# Altium schematic sheet SWAP_21DD_ LV_DR_Brush_Rev1.1.SchDoc
size Letter; SheetNumber: 1; SheetTotal: 1
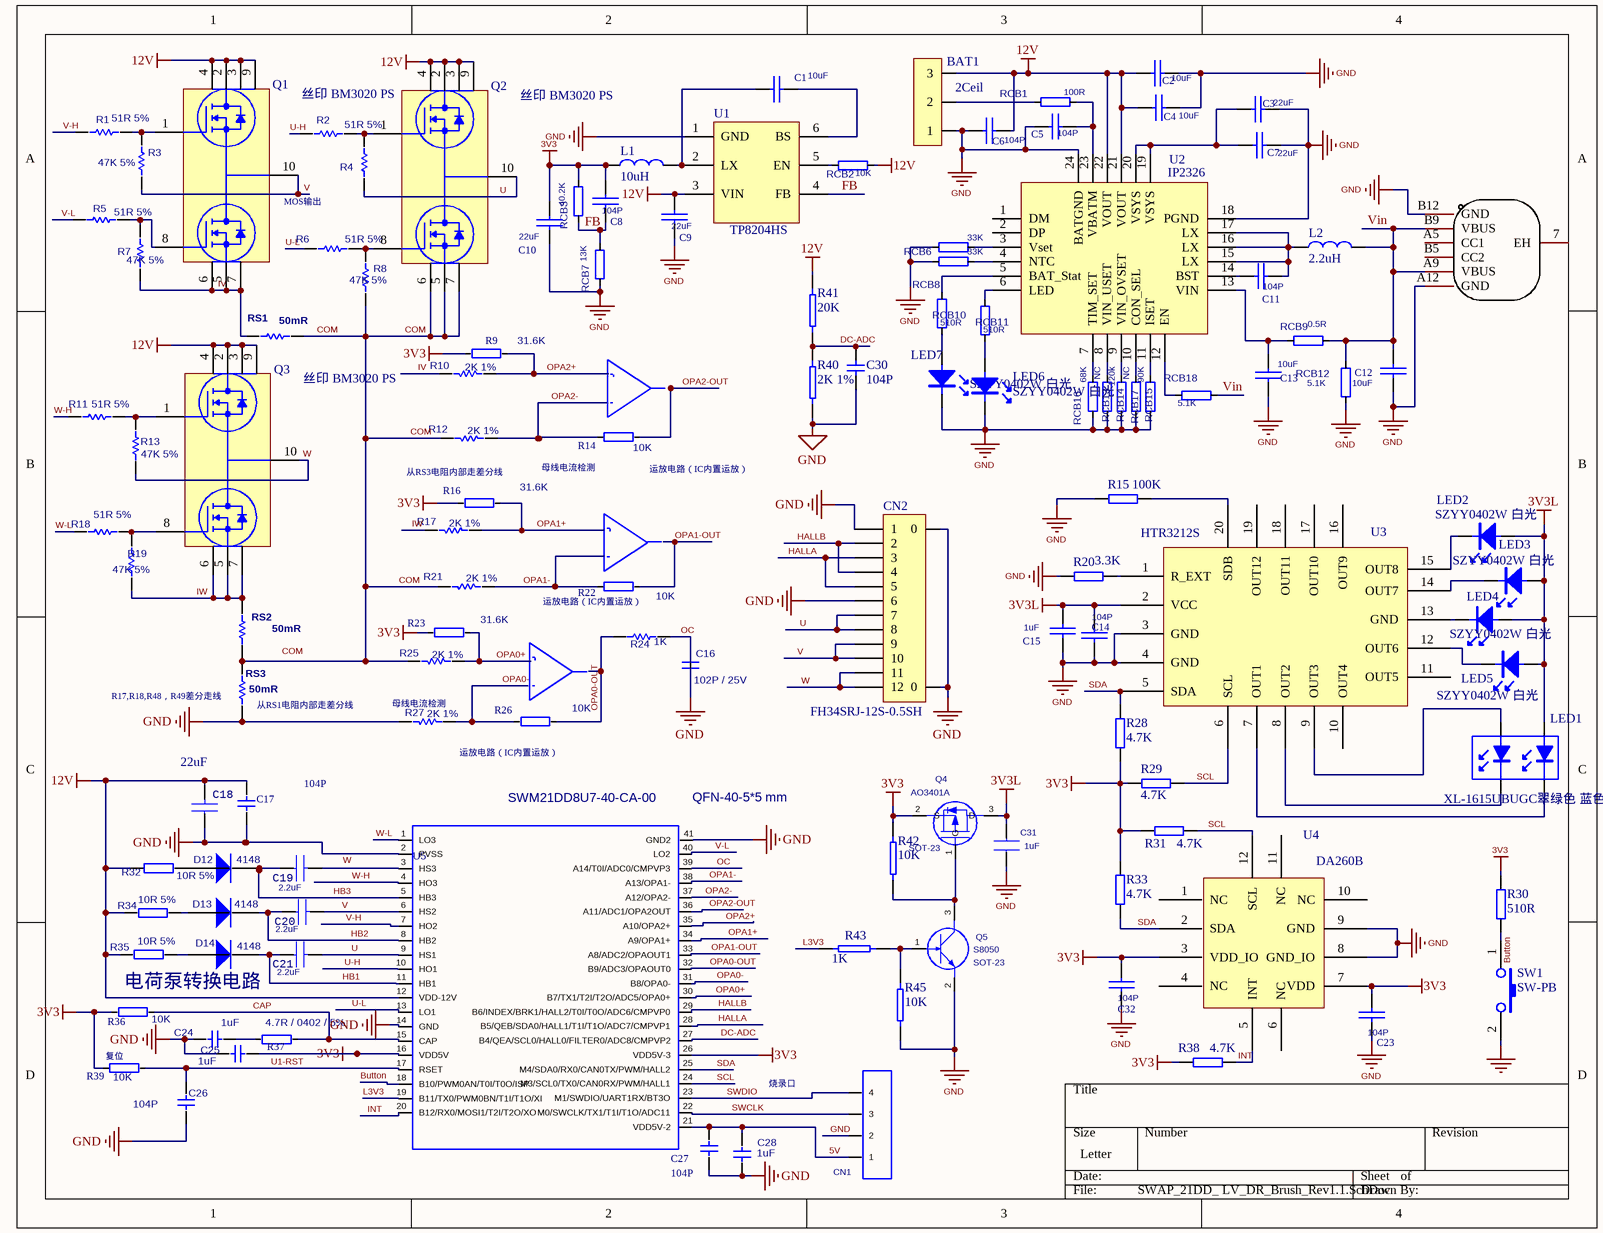
[diagram p0: SWAP_21DD_ LV_DR_Brush_Rev1.1.SchDoc]

## Parts
BAT1  2Ceil  [HDR1X3]
C1  10uF  [LC-0603_C]
C2  10uF  [LC-0603_C]
C3  22uF  [LC-0603_C]
C4  10uF  [LC-0603_C]
C5  104P  [LC-0402_C]
C6  104P  [LC-0402_C]
C7  22uF  [LC-0603_C]
C8  104P  [LC-0402_C]
C9  22uF  [LC-0603_C]
C10  22uF  [LC-0603_C]
C11  104P  [LC-0402_C]
C12  10uF  [LC-0402_C]
C13  10uF  [LC-0402_C]
C14  104P  [LC-0402_C]
C15  1uF  [LC-0402_C]
C16  102P / 25V  [LC-0402_C]
C17  104P  [LC-0402_C]
C18  22uF  [LC-0603_C]
C19  2.2uF  [LC-0603_C]
C20  2.2uF  [LC-0603_C]
C21  2.2uF  [LC-0603_C]
C23  104P  [LC-0402_C]
C24  1uF  [LC-0402_C]
C25  1uF  [LC-0402_C]
C26  104P  [LC-0402_C]
C27  104P  [LC-0402_C]
C28  1uF  [LC-0402_C]
C30  104P  [LC-0402_C]
C31  1uF  [LC-0402_C]
C32  104P  [LC-0402_C]
CN1  SWD1  [XH2.54-SMD4P]  (value not drawn)
CN2  FH34SRJ-12S-0.5SH  [SMD-12]
D12  4148  [LC-SOD-323]
D13  4148  [LC-SOD-323]
D14  4148  [LC-SOD-323]
L1  10uH  [L_0805]
L2  2.2uH  [L1206]
LED1  XL-1615UBUGC翠绿色 蓝色  [LED0402-4]
LED2  SZYY0402W 白光  [LED0402]
LED3  SZYY0402W 白光  [LED0402]
LED4  SZYY0402W 白光  [LED0402]
LED5  SZYY0402W 白光  [LED0402]
LED6  SZYY0402W 白光  [LED0402]
LED7  SZYY0402W 白光  [LED0402]
Q1  丝印 BM3020 PS  [DFN-3x3_8]
Q2  丝印 BM3020 PS  [DFN-3x3_8]
Q3  丝印 BM3020 PS  [DFN-3x3_8]
Q4  PCB DECAL: SOT-23  [LC-SOT-23(SOT-23-3)]  (hidden comment: AO3401A)
Q5  PCB DECAL: SOT-23  [SOT-723]  (hidden comment: S8050)
R1  51R 5%  [LC-0402_R]
R2  51R 5%  [LC-0402_R]
R3  47K 5%  [LC-0402_R]
R4  47K 5%  [LC-0402_R]  (value not drawn)
R5  51R 5%  [LC-0402_R]
R6  51R 5%  [LC-0402_R]
R7  47K 5%  [LC-0402_R]
R8  47K 5%  [LC-0402_R]
R9  31.6K  [LC-0402_R]
R10  2K 1%  [LC-0402_R]
R11  51R 5%  [LC-0402_R]
R12  2K 1%  [LC-0402_R]
R13  47K 5%  [LC-0402_R]
R14  10K  [LC-0402_R]
R15  100K  [LC-0402_R]
R16  31.6K  [LC-0402_R]
R17  2K 1%  [LC-0402_R]
R18  51R 5%  [LC-0402_R]
R19  47K 5%  [LC-0402_R]
R20  3.3K  [LC-0402_R]
R21  2K 1%  [LC-0402_R]
R22  10K  [LC-0402_R]
R23  31.6K  [LC-0402_R]
R24  1K  [LC-0402_R]
R25  2K 1%  [LC-0402_R]
R26  10K  [LC-0402_R]
R27  2K 1%  [LC-0402_R]
R28  4.7K  [LC-0402_R]
R29  4.7K  [LC-0402_R]
R30  510R  [LC-0402_R]
R31  4.7K  [LC-0402_R]
R32  10R 5%  [LC-0402_R]
R33  4.7K  [LC-0402_R]
R34  10R 5%  [LC-0402_R]
R35  10R 5%  [LC-0402_R]
R36  10K  [LC-0402_R]
R37  4.7R / 0402 / 5%  [LC-0402_R]
R38  4.7K  [LC-0402_R]
R39  10K  [LC-0402_R]
R40  2K 1%  [LC-0402_R]
R41  20K  [LC-0402_R]
R42  10K  [LC-0402_R]
R43  1K  [LC-0402_R]
R45  10K  [LC-0402_R]
RCB1  100R  [LC-0402_R]
RCB2  10K  [LC-0402_R]
RCB3  40.2K  [LC-0402_R]
RCB6  33K  [LC-0402_R]
RCB7  13K  [LC-0402_R]
RCB8  33K  [LC-0402_R]
RCB9  0.5R  [LC-0402_R]
RCB10  510R  [LC-0402_R]
RCB11  510R  [LC-0402_R]
RCB12  5.1K  [LC-0402_R]
RCB13  NC  [LC-0402_R]
RCB14  120k  [LC-0402_R]
RCB15  90K  [LC-0402_R]
RCB16  68K  [LC-0402_R]
RCB17  NC  [LC-0402_R]
RCB18  5.1K  [LC-0402_R]
RS1  50mR  [LC-0805_R]
RS2  50mR  [LC-0805_R]
RS3  50mR  [LC-0805_R]
SW1  SW-PB  [SW SMD-3*6*2.5]
U1  TP8204HS  [LC-SOT-23-6]
U2  IP2326  [QFN-24]
U3  HTR3212S  [QFN-20]
U4  DA260B  [LGA12]
U5  QFN32  [QFN40]  (value not drawn)
USB1  TYPE-C 6P(073)  [TYPE-C-SMD_6P]  (value not drawn)

## Nets
3V3: C8.1 C10.1 C23.1 C25.1 C32.1 L1.2 Q4.2(S) R9.2 R16.2 R23.2 R28.2 R29.1 R30.1 R31.1 R33.2 R36.1 R38.2 R39.1 R42.2 RCB3.2 U4.3(VDD_IO) U4.7(VDD) U5.16(VDD5V) U5.26(VDD5V-3)
3V3L: C14.1 C15.1 C31.1 LED1.3 LED2.1 LED3.1 LED4.1 LED5.1 Q4.3(D) U3.2(VCC)
12V: BAT1.3 C2.2 C4.2 C6.1 C9.1 C17.2 C18.2 Q1.2(D1) Q1.3(D1) Q1.4(D1) Q1.9(D1) Q2.2(D1) Q2.3(D1) Q2.4(D1) Q2.9(D1) Q3.2(D1) Q3.3(D1) Q3.4(D1) Q3.9(D1) R32.1 R34.1 R35.1 R41.2 RCB2.1 U1.3(VIN) U2.21(VOUT) U2.22(VOUT) U5.12(VDD-12V)
GND: BAT1.1 C2.1 C3.1 C4.1 C5.2 C6.2 C7.1 C9.2 C10.2 C12.2 C13.2 C14.2 C15.2 C16.1 C17.1 C18.1 C23.2 C24.1 C25.2 C26.2 C27.1 C28.1 C30.1 C31.2 C32.2 CN1.2 CN2.0 CN2.1 CN2.6 LED6.2 LED7.2 Q5.2(E) R15.2 R20.2 R27.1 R40.1 R45.2 RCB6.2 RCB7.1 RCB8.2 RCB12.2 RCB13.2 RCB14.2 RCB15.2 RCB16.2 RCB17.2 RS3.1 SW1.2 U1.1(GND) U2.18(PGND) U2.24(BATGND) U3.3(GND) U3.4(GND) U4.8(GND_IO) U4.9(GND) U5.2(PVSS) U5.14(GND) U5.41(GND2) USB1.A12(GND) USB1.B12(GND)
5V: C27.2 C28.2 CN1.1 U5.21(VDD5V-2)
Button: R30.2 SW1.1 U5.18(B10/PWM0AN/T0I/T0O/ISP)
CAP: R36.2 R37.2 U5.15(CAP)
COM: Q2.5(S2) Q2.6(S2) Q2.7(S2) R8.1 R12.1 R21.1 R25.1 RS1.1 RS2.1 RS3.2
DC-ADC: C30.2 R40.2 R41.1 U5.27(B4/QEA/SCL0/HALL0/FILTER0/ADC8/CMPVP2)
FB: C8.2 RCB3.1 RCB7.2 U1.4(FB)
HALLA: CN2.3 CN2.5 U5.28(B5/QEB/SDA0/HALL1/T1I/T1O/ADC7/CMPVP1)
HALLB: CN2.2 CN2.4 U5.29(B6/INDEX/BRK1/HALL2/T0I/T0O/ADC6/CMPVP0)
HB1: C21.1 D14.2(K) U5.11(HB1)
HB2: C20.1 D13.2(K) U5.8(HB2)
HB3: C19.1 D12.2(K) U5.5(HB3)
INT: R38.1 U4.5(INT) U5.20(B12/RX0/MOSI1/T2I/T2O/XO)
IV: Q1.5(S2) Q1.6(S2) Q1.7(S2) R7.1 R10.1 RS1.2
IW: Q3.5(S2) Q3.6(S2) Q3.7(S2) R17.1 R19.1 RS2.2
L3V3: R43.2 U5.19(B11/TX0/PWM0BN/T1I/T1O/XI)
OC: C16.2 R24.2 U5.39(A14/T0I/ADC0/CMPVP3)
OPA0+: R23.1 R25.2 U5.30(B7/TX1/T2I/T2O/ADC5/OPA0+)
OPA0-: R26.2 R27.2 U5.31(B8/OPA0-)
OPA0-OUT: R24.1 R26.1 U5.32(B9/ADC3/OPAOUT0)
OPA1+: R16.1 R17.2 U5.34(A9/OPA1+)
OPA1-: R21.2 R22.2 U5.38(A13/OPA1-)
OPA1-OUT: R22.1 U5.33(A8/ADC2/OPAOUT1)
OPA2+: R9.1 R10.2 U5.35(A10/OPA2+)
OPA2-: R12.2 R14.2 U5.37(A12/OPA2-)
OPA2-OUT: R14.1 U5.36(A11/ADC1/OPA2OUT)
SCL: R29.2 R31.2 U3.6(SCL) U4.12(SCL) U5.24(M3/SCL0/TX0/CAN0RX/PWM/HALL1)
SDA: R28.1 R33.1 U3.5(SDA) U4.2(SDA) U5.25(M4/SDA0/RX0/CAN0TX/PWM/HALL2)
SWCLK: CN1.3 U5.22(M0/SWCLK/TX1/T1I/T1O/ADC11)
SWDIO: CN1.4 U5.23(M1/SWDIO/UART1RX/BT3O)
U: C21.2 CN2.7 CN2.8 Q2.10(S1/D2) R4.2 U5.9(HS1)
U1-RST: C26.1 R39.2 U5.17(RSET)
U-H: R2.1 U5.10(HO1)
U-L: R6.1 U5.13(LO1)
V: C20.2 CN2.9 CN2.10 Q1.10(S1/D2) R3.1 U5.6(HS2)
V-H: R1.1 U5.7(HO2)
V-L: R5.1 U5.40(LO2)
Vin: C12.1 L2.1 RCB9.2 RCB12.1 RCB18.2 USB1.A9(VBUS) USB1.B9(VBUS)
W: CN2.11 CN2.12 Q3.10(S1/D2) R13.1
W-H: R11.1 U5.4(HO3)
W-L: R18.1 U5.1(LO3)
NetBAT1_2: BAT1.2 RCB1.2
NetC1_1: C1.1 L1.1 U1.2(LX)
NetC1_2: C1.2 U1.6(BS)
NetC3_2: C3.2 C7.2 U2.19(VSYS) U2.20(VSYS)
NetC5_1: C5.1 RCB1.1 U2.23(VBATM)
NetC11_1: C11.1 U2.14(BST)
NetC11_2: C11.2 L2.2 U2.15(LX) U2.16(LX) U2.17(LX)
NetC13_1: C13.1 RCB9.1 U2.13(VIN)
NetC19_2: C19.2 U5.3(HS3)
NetC24_2: C24.2 R37.1
NetD12_1: D12.1(A) R32.2
NetD13_1: D13.1(A) R34.2
NetD14_1: D14.1(A) R35.2
NetLED1_1: LED1.1 U3.8(OUT2)
NetLED1_2: LED1.2 U3.7(OUT1)
NetLED1_4: LED1.4 U3.9(OUT3)
NetLED2_2: LED2.2 U3.15(OUT8)
NetLED3_2: LED3.2 U3.14(OUT7)
NetLED4_2: LED4.2 U3.13(GND)
NetLED5_2: LED5.2 U3.12(OUT6)
NetLED6_1: LED6.1 RCB11.1
NetLED7_1: LED7.1 RCB10.1
NetQ1_1: Q1.1(G1) R1.2 R3.2
NetQ1_8: Q1.8(G2) R5.2 R7.2
NetQ2_1: Q2.1(G1) R2.2 R4.1
NetQ2_8: Q2.8(G2) R6.2 R8.2
NetQ3_1: Q3.1(G1) R11.2 R13.2
NetQ3_8: Q3.8(G2) R18.2 R19.2
NetQ4_1: Q4.1(G) Q5.3(C) R42.1
NetQ5_1: Q5.1(B) R43.1 R45.1
NetR15_1: R15.1 U3.20(SDB)
NetR20_1: R20.1 U3.1(R_EXT)
NetRCB2_2: RCB2.2 U1.5(EN)
NetRCB6_1: RCB6.1 U2.3(Vset)
NetRCB8_1: RCB8.1 U2.4(NTC)
NetRCB10_2: RCB10.2 U2.5(BAT_Stat)
NetRCB11_2: RCB11.2 U2.6(LED)
NetRCB13_1: RCB13.1 U2.8(VIN_USET)
NetRCB14_1: RCB14.1 U2.9(VIN_OVSET)
NetRCB15_1: RCB15.1 U2.11(ISET)
NetRCB16_1: RCB16.1 U2.7(TIM_SET)
NetRCB17_1: RCB17.1 U2.10(CON_SEL)
NetRCB18_1: RCB18.1 U2.12(EN)

Not connected (* = marked no-connect by the designer): U2 1(DM) 2(DP); U3 10(OUT4) 11(OUT5) 16(OUT9) 17(OUT10) 18(OUT11) 19(OUT12); U4 1(NC) 4(NC) 6(NC) 10(NC) 11(NC); USB1 7(EH) A5(CC1) B5(CC2)

## Notes on the sheet
- (near Q1) MOS输出
- 从RS3电阻内部走差分线
- 母线电流检测
- (near R14) 运放电路（IC内置运放）
- (near R22) 运放电路（IC内置运放）
- R17,R18,R48，R49差分走线
- (near RS3) 从RS1电阻内部走差分线
- (near R27) 母线电流检测
- 运放电路（IC内置运放）
- (near U5) SWM21DD8U7-40-CA-00
- (near U5) QFN-40-5*5 mm
- 电荷泵转换电路
- (near R39) 复位
- 烧录口
- Labels drawn without touching a wire or pin: COM, W

## Library data of the parts
BAT1 = BAT: Connector
C1-C15 C23 C32 = CC: Capacitor; PCB DECAL: C0603
C16 = C0603: 贴片瓷片电容; Value: 100nF; Published: 8-Jun-2000; LatestRevisionDate: 17-Jul-2002; LatestRevisionNote: Re-released for DXP Platform.; PackageReference: RAD-0.3; Publisher: Altium Limited; PCB DECAL: C0603; Comment_1: C0603
C17 C24-C28 = CAP_S: PCB DECAL: C0603; Comment_1: CAP_S
C18 = C0805: SMT Resistor 5% UniOhm(厚声); Part_Shape: 0603; Source_Path: E:\GTCS-A01-SWM-P9项目\GTCS-A01-SWM-P9项目V1.2\GTCS-A01-SWM-P9-V1.2.原理图\99.DSN; ValueRank: 33R; ForPin: Pin; Designator: R1C; Contributor: LCEDA_Lib; Published: 8-Jun-2000; LatestRevisionDate: 17-Jul-2002; LatestRevisionNote: Re-released for DXP Platform.; PackageReference: 0805; Publisher: Altium Limited; PackageDescription: Radial Cap, Thru-Hole; 2 Leads; 0.3 in Pin Spacing; PCB DECAL: C0805; MountType: SMT; Footprint: 0805; Accuracy: 5%; spicePre: R; spiceSymbolName: R_0603_EU; Comment_1: C0805
C19-C21 = C0805: Part_Shape: 0603; Source_Path: E:\GTCS-A01-SWM-P9项目\GTCS-A01-SWM-P9项目V1.2\GTCS-A01-SWM-P9-V1.2.原理图\99.DSN; PCB DECAL: C0805
C30 = CAP_S
C31 = CAPACITOR: Source_Path: F:\T2700\LIBRARY1.OLB; Value: 1uF
CN1 = 4P-2.54-8: 接插件  DS-5.1CN4  DS-2.54CWB-4; PCB DECAL: 4P-2.54-8; Comment_1: 4P-2.54-8
CN2 = CON12: Connector
D12-D14 = DIODE: Default Diode; PCB DECAL: SOD-123/3; Published: 8-Jun-2000; LatestRevisionDate: 17-Jul-2002; LatestRevisionNote: Re-released for DXP Platform.; PackageVersion: Sep-1996; PackageReference: SMC; Publisher: Altium Limited; PackageDescription: DO-214-AB/SMC; 2 C-Bend Leads; Body 7.9 x 5.9 mm, inc. leads (LxW); Code_JEDEC: DO-214-AB; Comment_1: DIODE
L1 L2 = L - 5x4: 电感
LED1 = LED-1
LED2-LED7 = LED
Q1-Q3 = CJBM3020
Q4 = PMOS_3: Source_Path: F:\T27XX\MAIN BOARD\T27XX_MAIN_V0D0_20211205.DSN; Value: AO3401A
Q5 = NPN: Source_Path: F:\T2700\LIBRARY1.OLB; Value: S8050
R1-R8 R10-R13 R17-R19 R21 R25 R27 = RES_SEMI: Semiconductor Resistor; Value: 1K; PCB DECAL: R0603; Published: 8-Jun-2000; LatestRevisionDate: 17-Jul-2002; LatestRevisionNote: Re-released for DXP Platform.; PackageReference: AXIAL-0.5; Publisher: Altium Limited; PackageDescription: Axial Device, Thru-Hole; 2 Leads; 0.5 in Pin Spacing; Comment_1: RES_SEMI
R9 R14 R16 R22 R23 R26 R36 R37 R39 = R0402: 贴片电阻; Value: 1K; PCB DECAL: R0603; Published: 8-Jun-2000; LatestRevisionDate: 17-Jul-2002; LatestRevisionNote: Re-released for DXP Platform.; Publisher: Altium Limited; Comment_1: R0402
  R9 R14 R16 R22 R23 R26: PackageReference: AXIAL-0.5; PackageDescription: Axial Device, Thru-Hole; 2 Leads; 0.5 in Pin Spacing
  R36 R37 R39: PackageReference: AXIAL-0.4
R15 R20 R28-R31 R33 R38 = R: Resistance
R24 = RES_SEMI: Semiconductor Resistor; PCB DECAL: R0603; Published: 8-Jun-2000; LatestRevisionDate: 17-Jul-2002; LatestRevisionNote: Re-released for DXP Platform.; PackageReference: AXIAL-0.5; Publisher: Altium Limited; PackageDescription: Axial Device, Thru-Hole; 2 Leads; 0.5 in Pin Spacing; Value: 1K; Comment_1: RES_SEMI
R32 R34 R35 = RES_T: PCB DECAL: R1206; Comment_1: RES_T
R40-R43 R45 = RES1
RCB1-RCB3 RCB6-RCB18 = RR: 贴片 电阻器; Value: 1K; PCB DECAL: R0603; SMD/DIP/WELDING: SMD; Published: 8-Jun-2000; LatestRevisionDate: 17-Jul-2002; LatestRevisionNote: Re-released for DXP Platform.; PackageReference: AXIAL-0.5; Publisher: Altium Limited; PackageDescription: Axial Device, Thru-Hole; 2 Leads; 0.5 in Pin Spacing
RS1-RS3 = RES_2512: Semiconductor Resistor; Value: 1K; PCB DECAL: 2512R_6332; Published: 8-Jun-2000; LatestRevisionDate: 17-Jul-2002; LatestRevisionNote: Re-released for DXP Platform.; PackageReference: AXIAL-0.5; Publisher: Altium Limited; PackageDescription: Axial Device, Thru-Hole; 2 Leads; 0.5 in Pin Spacing; Comment_1: RES_2512
U5 = SWM21DD8U7: PCB DECAL: SWM21DK6U7_QFN32_5X5_BA00
USB1 = TYPE-C 6P: Manufacturer: SHOU HAN(首韩); Add into BOM: yes; Gender: 母; Number of Ports: 1; Current Rating - Power (Max): 5A; Symbol: TYPE-C 6P(073); Device: TYPE-C 6P(073); Supplier: LCSC; Supplier Part: C668623; Manufacturer Part: TYPE-C 6P(073); JLCPCB Part Class: Extended Part; LCSC Part Name: Type-C 母 卧贴; Supplier Footprint: SMD; Datasheet: https://atta.szlcsc.com/upload/public/pdf/source/20200618/C668623_A4B260DED7AC1949BAC6AE39E9F4CD80.pdf; Convert to PCB: yes; Connector Type: Type-C; Standard: -; Number of Contacts: 6P; Mounting Style: 卧贴; Operating Temperature Range: -25℃~+85℃